# EAGLE design KitTen (EAGLE 6.5.0)
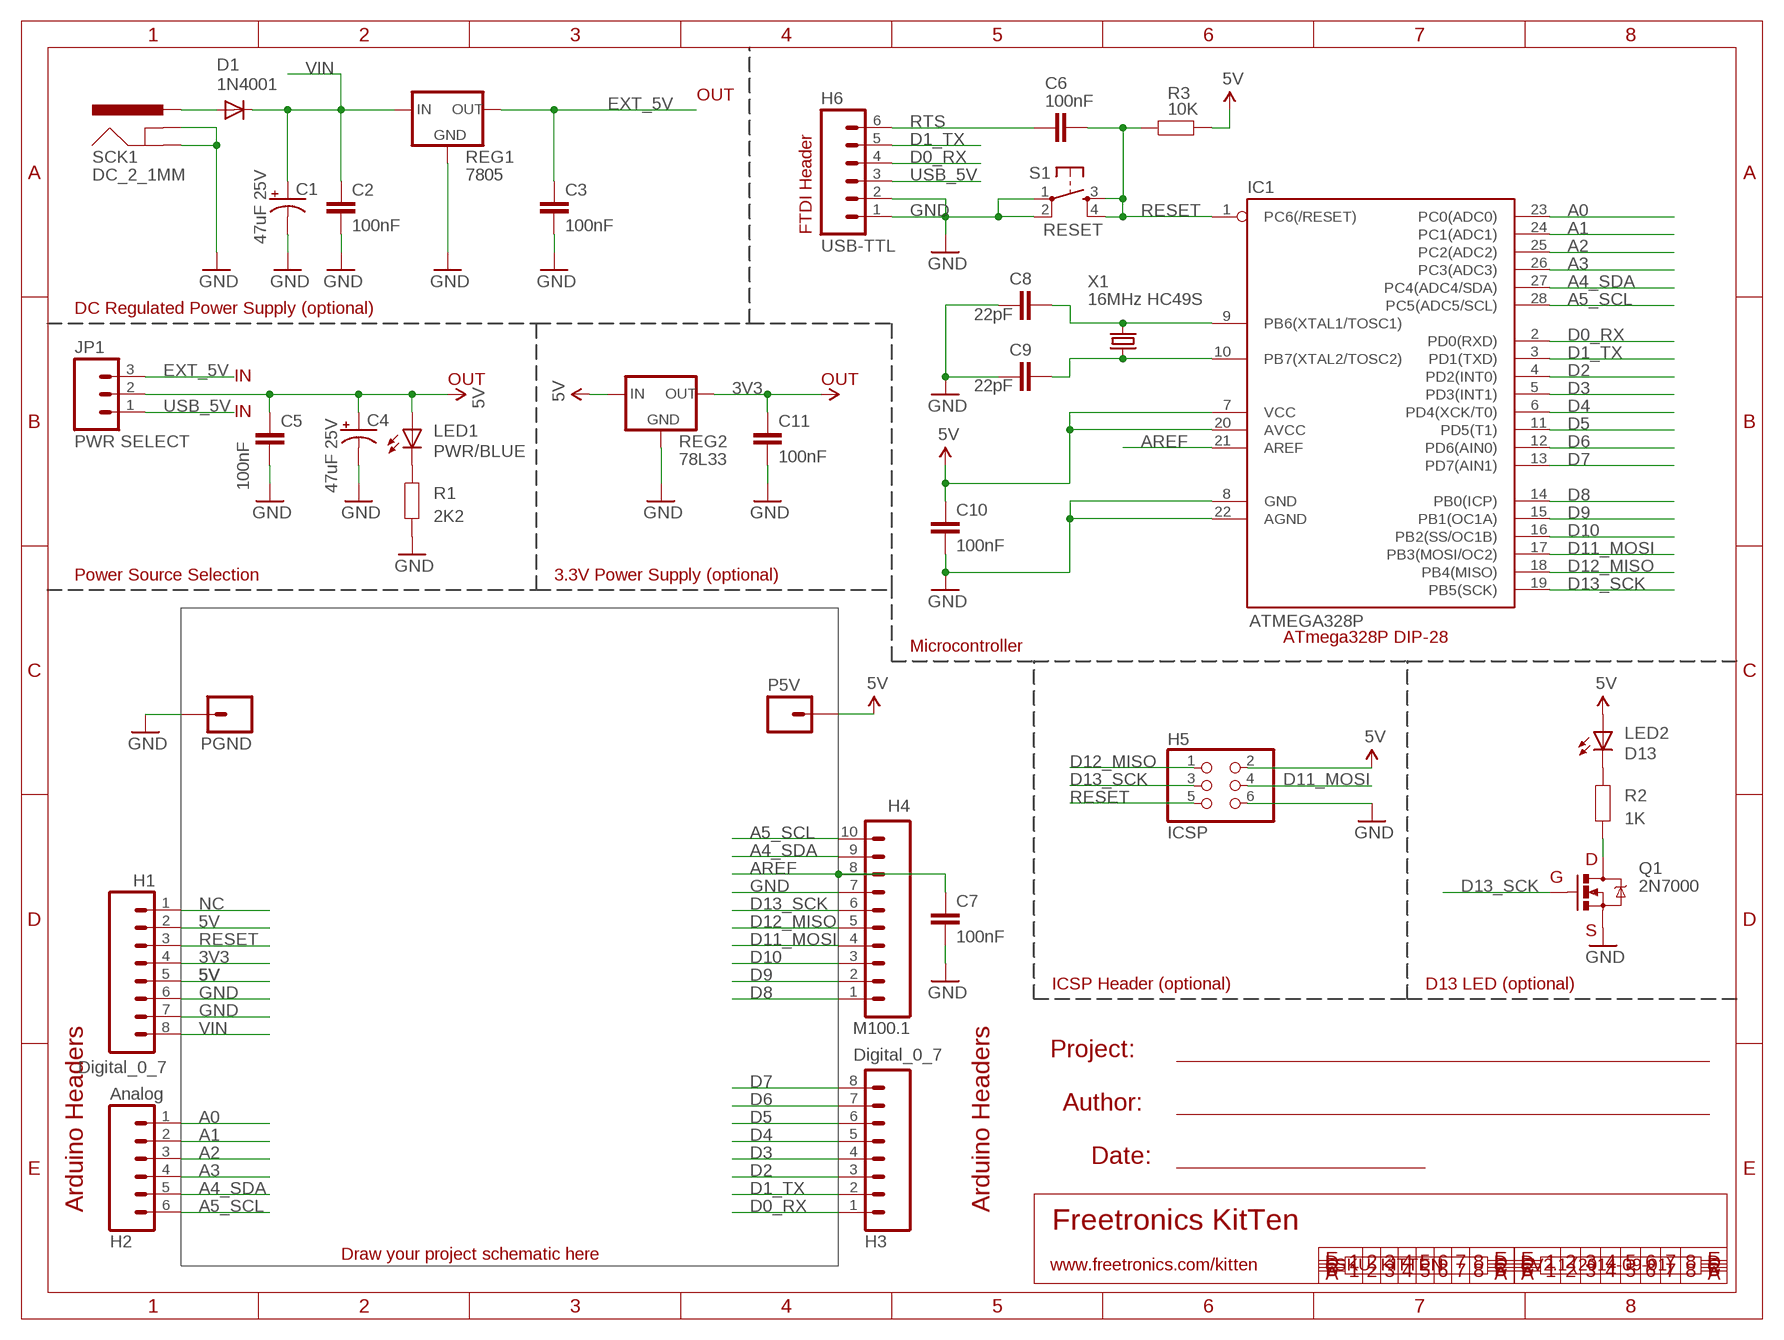
[diagram p0: schematic, sheet 1]

## Parts
C1  47uF 25V  CAP_POLPTH2  [CPOL-RADIAL-10UF-25V]
C2  100nF  CAPPTH  [CAP-PTH-SMALL]
C3  100nF  CAPPTH  [CAP-PTH-SMALL]
C4  47uF 25V  CAP_POLPTH2  [CPOL-RADIAL-10UF-25V]
C5  100nF  CAPPTH  [CAP-PTH-SMALL]
C6  100nF  CAPPTH  [CAP-PTH-SMALL]
C7  100nF  CAPPTH  [CAP-PTH-SMALL]
C8  22pF  CAPPTH  [CAP-PTH-SMALL]
C9  22pF  CAPPTH  [CAP-PTH-SMALL]
C10  100nF  CAPPTH  [CAP-PTH-SMALL]
C11  100nF  CAPPTH  [CAP-PTH-SMALL]
D1  1N4001  DIODEPTH  [DIODE-1N4001]
H1  Digital_0_7  M08  [1X08]
H2  Analog  M06SIP  [1X06]
H3  Digital_0_7  M08  [1X08]
H4  M100.1  [1X10]
H5  ICSP  PINHD-2X3  [2X03]
H6  USB-TTL  M06SIP  [1X06]
IC1  ATMEGA328P  AVR-MEGA8-P  [DIL28-3]
JP1  PWR SELECT  M03PTH  [1X03]
LED1  PWR/BLUE  LED3MM  [LED3MM]
LED2  D13  LED3MM  [LED3MM]
P5V  M01SMD  [LUXEON-PAD]
PGND  M01SMD  [LUXEON-PAD]
Q1  2N7000  MOSFET-NTO-92  [TO92]
R1  2K2  RESISTORPTH1  [AXIAL-0.3]
R2  1K  RESISTORPTH1  [AXIAL-0.3]
R3  10K  RESISTORPTH1  [AXIAL-0.3]
REG1  7805  V_REG_78XXSIDE  [78XXL]
REG2  78L33  78LXX  [TO92]
S1  RESET  TAC_SWITCHPTH  [TACTILE-PTH]
SCK1  DC_2_1MM  POWER_JACKPTH  [POWER_JACK_PTH]
X1  16MHz HC49S  CRYSTALHC49UV  [HC49U-V]

## Nets
3V3: C11.1 H1.4 REG2.1(OUT) ; supply symbol labelled 3.3V
5V: C4.1(+) C5.1 C10.1 H1.2 H1.5 H5.2 IC1.7(VCC) IC1.20(AVCC) JP1.2 LED1.A LED2.A P5V.P$1 R3.P$2 REG2.3(IN)
A0: H2.1 IC1.23(PC0(ADC0))
A1: H2.2 IC1.24(PC1(ADC1))
A2: H2.3 IC1.25(PC2(ADC2))
A3: H2.4 IC1.26(PC3(ADC3))
A4_SDA: H2.5 H4.9 IC1.27(PC4(ADC4/SDA))
A5_SCL: H2.6 H4.10 IC1.28(PC5(ADC5/SCL))
AREF: C7.1 H4.8 IC1.21(AREF)
D0_RX: H3.1 H6.4 IC1.2(PD0(RXD))
D1_TX: H3.2 H6.5 IC1.3(PD1(TXD))
D2: H3.3 IC1.4(PD2(INT0))
D3: H3.4 IC1.5(PD3(INT1))
D4: H3.5 IC1.6(PD4(XCK/T0))
D5: H3.6 IC1.11(PD5(T1))
D6: H3.7 IC1.12(PD6(AIN0))
D7: H3.8 IC1.13(PD7(AIN1))
D8: H4.1 IC1.14(PB0(ICP))
D9: H4.2 IC1.15(PB1(OC1A))
D10: H4.3 IC1.16(PB2(SS/OC1B))
D11_MOSI: H4.4 H5.4 IC1.17(PB3(MOSI/OC2))
D12_MISO: H4.5 H5.1 IC1.18(PB4(MISO))
D13_SCK: H4.6 H5.3 IC1.19(PB5(SCK)) Q1.2(G)
EXT_5V: C3.1 JP1.3 REG1.OUT
GND: C1.2(-) C2.2 C3.2 C4.2(-) C5.2 C7.2 C8.1 C9.1 C10.2 C11.2 H1.6 H1.7 H4.7 H5.6 H6.1 H6.2 IC1.8(GND) IC1.22(AGND) PGND.P$1 Q1.1(S) R1.P$1 REG1.GND REG2.2(GND) S1.1 S1.2 SCK1.GND SCK1.GNDBREAK
N$4: LED2.K(C) R2.P$2
N$5: C8.2 IC1.9(PB6(XTAL1/TOSC1)) X1.2
N$6: Q1.3(D) R2.P$1
N$7: C9.2 IC1.10(PB7(XTAL2/TOSC2)) X1.1
N$8: D1.A SCK1.PWR
N$14: LED1.K(C) R1.P$2
NC: H1.1
RESET: C6.2 H1.3 H5.5 IC1.1(PC6(/RESET)) R3.P$1 S1.3 S1.4
RTS: C6.1 H6.6
USB_5V: H6.3 JP1.1
VIN: C1.1(+) C2.1 D1.C H1.8 REG1.IN

## Notes on the sheet
- OUT
- FTDI Header
- DC Regulated Power Supply (optional)
- IN | OUT | OUT
- IN
- Power Source Selection | 3.3V Power Supply (optional)
- ATmega328P DIP-28
- Microcontroller
- D
- G
- S
- ICSP Header (optional) | D13 LED (optional)
- Project:
- Author:
- Date:
- Arduino Headers | Arduino Headers
- Freetronics KitTen
- Draw your project schematic here
- www.freetronics.com/kitten | SKU: KITTEN | V2.1 (2014-09-01)

## Library data of the parts
C1 C4 = freetronics-jon.1:CAP_POL: Capacitor Polarized These are standard SMD and PTH capacitors. Normally 10uF, 47uF, and 100uF in electrolytic and tantalum varieties. Always verify the external diameter of the through hole cap, it varies with capacity, voltage, and manufacturer. The EIA devices should be standard.
C2 C3 C5-C11 = freetronics-2:CAP: Capacitor Standard 0603 ceramic capacitor, and 0.1" leaded capacitor.
D1 = freetronics-2:DIODE: Diode These are standard reverse protection diodes and small signal diodes. SMA package can handle up to about 1A. SOD-323 can handle about 200mA. What the SOD-323 package when ordering, there are some mfgs out there that are 5-pin packages.
H1 H3 = freetronics:M08: Header 8 Standard 8-pin 0.1" header. Use with straight break away headers (SKU : PRT-00116), right angle break away headers (PRT-00553), swiss pins (PRT-00743), machine pins (PRT-00117), and female headers (PRT-00115).
H2 H6 = freetronics:M06: Header 6 Standard 6-pin 0.1" header. Use with straight break away headers (SKU : PRT-00116), right angle break away headers (PRT-00553), swiss pins (PRT-00743), machine pins (PRT-00117), and female headers (PRT-00115). Molex polarized connector foot print use with SKU : PRT-08094 with associated crimp pins and housings. NOTES ON THE VARIANTS LOCK and LOCK_LONGPADS... This footprint was designed to help hold the alignment of a through-hole component (i.e. 6-pin header) while soldering it into place. You may notice that each hole has been shifted either up or down by 0.005 of an inch from it's more standard position (which is a perfectly straight line). This slight alteration caused the pins (the squares in the middle) to touch the edges of the holes. Because they are alternating, it causes a "brace" to hold the component in place. 0.005 has proven to be the perfect amount of "off-center" position when using our standard breakaway headers. Although looks a little odd when you look at the bare footprint, once you have a header in there, the alteration is very hard to notice. Also, if you push a header all the way into place, it is covered up entirely on the bottom side. This idea of altering the position of holes to aid alignment will be further integrated into the Sparkfun Library for other footprints. It can help hold any component with 3 or more connection pins.
H4 = freetronics-marc:M10: Header 10 Standard 10-pin 0.1" header. Use with straight break away headers (SKU : PRT-00116), right angle break away headers (PRT-00553), swiss pins (PRT-00743), machine pins (PRT-00117), and female headers (PRT-00115).
H5 = pinhead:PINHD-2X3: PIN HEADER
IC1 = freetronics:AVR-MEGA8-P: MICROCONTROLLER 8 Kbytes FLASH 1 kbytes SRAM 512 bytes EEPROM USART 4-channel 10 bit ADC 2-channel 8 bit ADC
JP1 = freetronics-2:M03: Header 3 Standard 3-pin 0.1" header. Use with straight break away headers (SKU : PRT-00116), right angle break away headers (PRT-00553), swiss pins (PRT-00743), machine pins (PRT-00117), and female headers (PRT-00115). Molex polarized connector foot print use with SKU : PRT-08232 with associated crimp pins and housings.
LED1 LED2 = freetronics-2:LED: LEDs Standard schematic elements and footprints for 5mm, 3mm, 1206, and 0603 sized LEDs. 5mm - Spark Fun Electronics SKU : COM-00529 (and others)
P5V PGND = freetronics:M01: Header 1 Standard 1-pin 0.1" header. Use with straight break away headers (SKU : PRT-00116), right angle break away headers (PRT-00553), swiss pins (PRT-00743), machine pins (PRT-00117), and female headers (PRT-00115).
Q1 = freetronics-jon:MOSFET-N: Basic N-Channel MOSFET
R1-R3 = freetronics-2:RESISTOR: Resistor Basic schematic elements and footprints for 0603, 1206, and PTH 1/10th watt (small) resistors.
REG1 = freetronics-2:V_REG_78XX: Voltage Regulator Standard 7805 5V regulator. IGO (Input Ground Output). Spark Fun Electronics SKU : COM-00107
REG2 = freetronics-jon:78LXX
S1 = freetronics-2:TAC_SWITCH: Momentary Switch Button commonly used for reset or general input. Spark Fun Electronics SKU : COM-00097
SCK1 = freetronics:POWER_JACK: Power Jack This is the standard 5.5mm barrel jack for power. The PTH is the most common, proven, reliable, footprint. All others are experimental. The Slot footprint only works if the mill layer is transmitted to the PCB fab house so be warned. Spark Fun Electronics SKU : PRT-00119. Mating wall wart : TOL-00298 (and others)
X1 = freetronics:CRYSTAL: Crystals Various standard crystals. Proven footprints. Spark Fun Electronics SKU : COM-00534

## Board
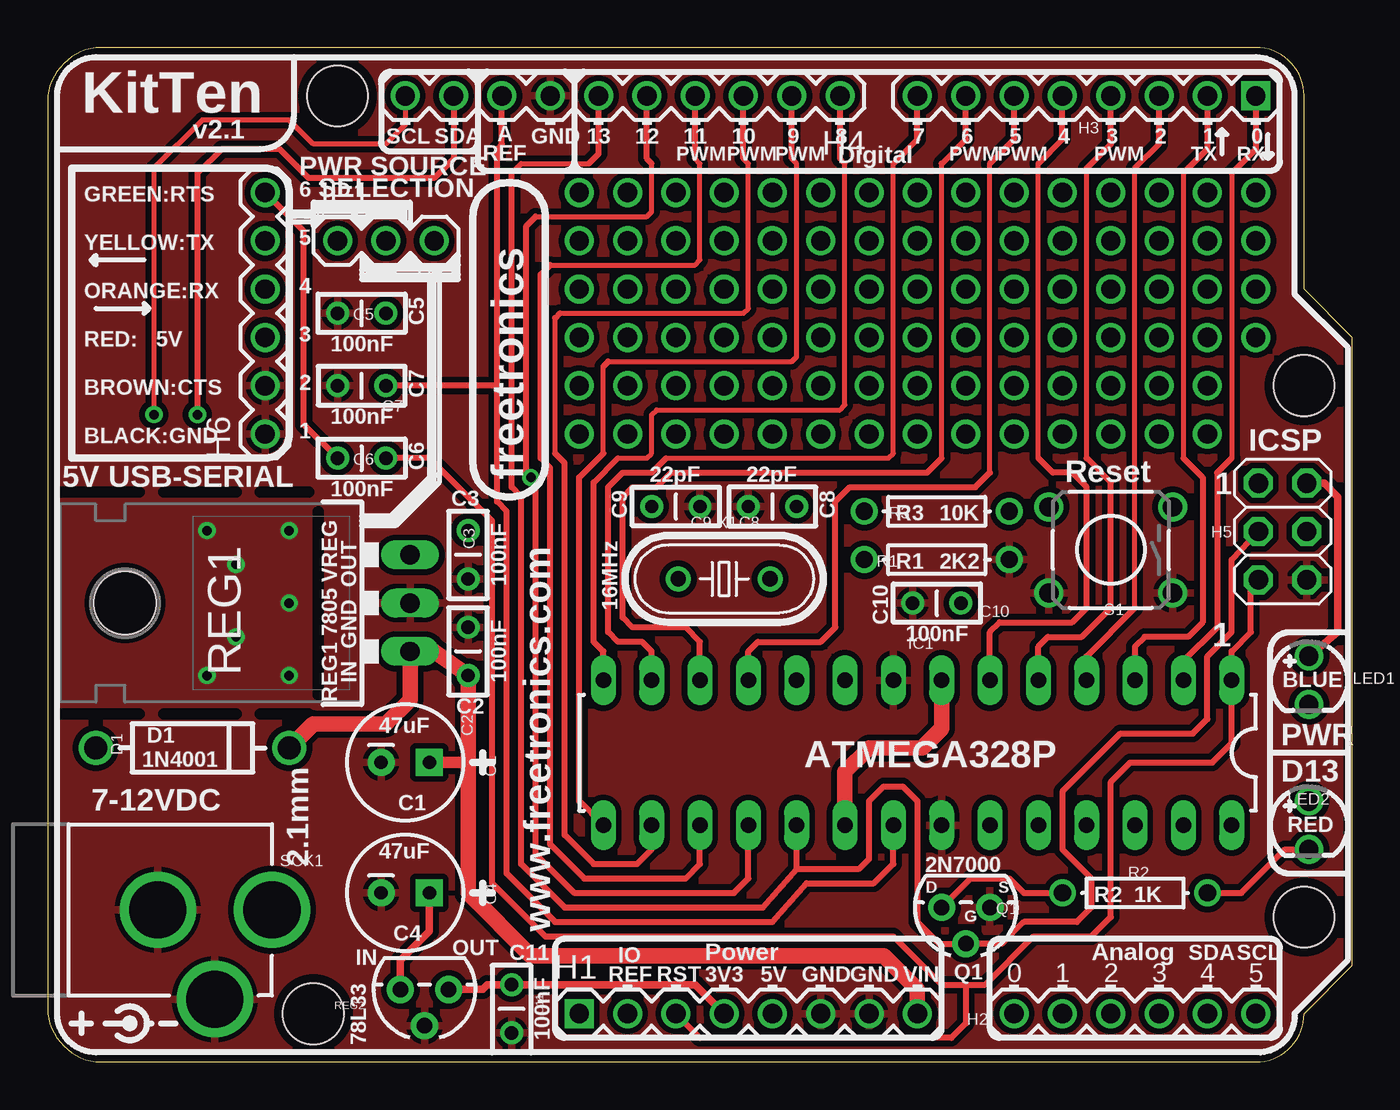
[diagram p1: board, top side]
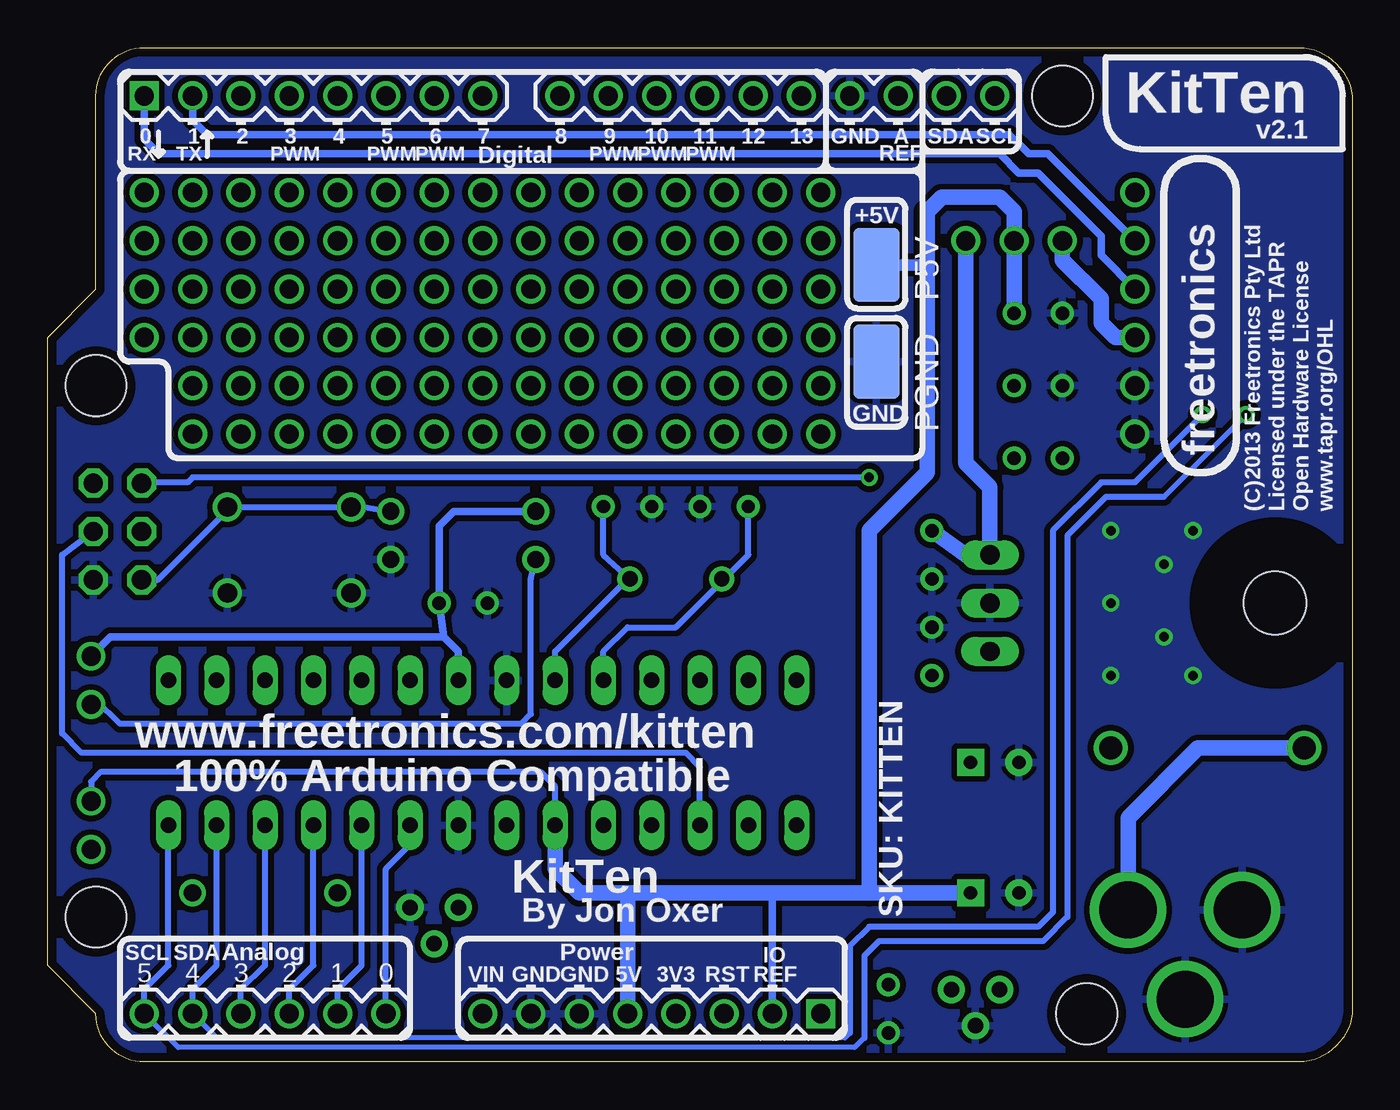
[diagram p2: board, bottom side, seen from below]

Size 68.58 x 53.34 mm. Coordinates in mm from the lower left corner, seen from the top.
Outline: 0,2.54 arc74 2.54,0 63.5,0 arc90 66.04,2.54 68.58,5.08 68.58,38.1 66.04,40.64 66.04,50.8 arc90 63.5,53.34 2.54,53.34 arc74 0,50.8 0,2.54
Copper layers (1*16): Top 0.035mm / dielectric 1.5mm / Bottom 0.035mm
Design rules "default *": minimum track width 10mil, minimum drill 18mil, track to track 10mil, track to pad 10mil, pad to pad 10mil, via to via 10mil, smd to smd 8mil, copper to edge 18mil, drill to drill 8mil, minimum pad ring 10mil, minimum via ring 8mil, stop-mask expansion 4mil, vias tented up to drill 25mil, thermal gap 10mil
Holes 3.2 mm at 66.04,35.56 66.04,7.62 15.24,50.8 13.97,2.54
tRestrict: 7 lines

### Footprints (pad centres in the part's own frame; a part is rotated, then mirrored left to right if it is on the bottom)
CPOL-RADIAL-10UF-25V = drill 0.7 pad 1.422 square: 1 1.27,0 | drill 0.7 pad 1.422: 2 -1.27,0
CAP-PTH-SMALL = drill 0.7: 1 0,0; 2 2.54,0
DIODE-1N4001 = drill 1.2: A -5.08,0; C 5.08,0
1X08 = drill 1.016 square: 1 0,0 | drill 1.016: 2 2.54,0; 3 5.08,0; 4 7.62,0; 5 10.16,0; 6 12.7,0; 7 15.24,0; 8 17.78,0
1X06 = drill 1.016: 1 0,0; 2 2.54,0; 3 5.08,0; 4 7.62,0; 5 10.16,0; 6 12.7,0
1X10 = drill 1.016: 1 0,0; 2 2.54,0; 3 5.08,0; 4 7.62,0; 5 10.16,0; 6 12.7,0; 7 15.24,0; 8 17.78,0; 9 20.32,0; 10 22.86,0
2X03 = drill 1.016 octagon: 1 -2.54,-1.27; 2 -2.54,1.27; 3 0,-1.27; 4 0,1.27; 5 2.54,-1.27; 6 2.54,1.27
DIL28-3 = drill 0.813 long: 1 -16.51,-3.81; 2 -13.97,-3.81; 3 -11.43,-3.81; 4 -8.89,-3.81; 5 -6.35,-3.81; 6 -3.81,-3.81; 7 -1.27,-3.81; 8 1.27,-3.81; 9 3.81,-3.81; 10 6.35,-3.81; 11 8.89,-3.81; 12 11.43,-3.81; 13 13.97,-3.81; 14 16.51,-3.81; 15 16.51,3.81; 16 13.97,3.81; 17 11.43,3.81; 18 8.89,3.81; 19 6.35,3.81; 20 3.81,3.81; 21 1.27,3.81; 22 -1.27,3.81; 23 -3.81,3.81; 24 -6.35,3.81; 25 -8.89,3.81; 26 -11.43,3.81; 27 -13.97,3.81; 28 -16.51,3.81
1X03 = drill 1.016: 1 0,0; 2 2.54,0; 3 5.08,0
LED3MM = drill 1: A -1.27,0; K 1.27,0
LUXEON-PAD = smd 3.9 x 2.4: P$1 0,0
TO92 = drill 0.813 pad 1.422: 1 -1.27,0; 2 0,1.905; 3 1.27,0
AXIAL-0.3 = drill 0.9: P$1 -3.81,0; P$2 3.81,0
78XXL = drill 1.016 long: GND 0,-3.81; IN -2.54,-3.81; OUT 2.54,-3.81 | hole 3.302: 0,11.176
TACTILE-PTH = drill 1.016: 1 -3.251,2.261; 2 3.251,2.261; 3 -3.251,-2.261; 4 3.251,-2.261
POWER_JACK_PTH = drill 2.997: GND 0,7.7; GNDBREAK 4.7,10.7; PWR 0,13.7
HC49U-V = drill 0.813: 1 -2.413,0; 2 2.413,0

### Placement (x,y rotation side)
C1  18.8,15.75 0 top
C2  22.1,20.32 90 top
C3  22.1,27.94 270 top
C4  18.8,8.89 0 top
C5  17.78,39.37 180 top
C6  15.24,31.75 0 top
C7  17.78,35.56 180 top
C8  36.83,29.21 0 top
C9  34.29,29.21 180 top
C10  48.01,24.13 180 top
C11  24.38,4.06 270 top
D1  7.62,16.51 0 top
H1  27.94,2.54 0 top
H2  50.8,2.54 0 top
H3  63.5,50.8 180 top
H4  41.66,50.8 180 top
H5  64.91,27.89 270 top
H6  11.43,33.02 90 top
IC1  45.72,16.26 180 top
JP1  15.24,43.18 0 top
LED1  66.29,20.07 270 top
LED2  66.29,12.45 270 top
P5V  25.02,41.91 270 bottom
PGND  25.02,36.83 270 bottom
Q1  48.26,8.13 180 top
R1  46.74,26.42 180 top
R2  57.15,8.89 0 top
R3  46.74,28.96 180 top
REG1  15.24,24.13 90 top
REG2  19.81,3.81 180 top
S1  55.88,26.92 180 top
SCK1  -1.91,8 270 top
X1  35.56,25.4 0 top

### Tracks (layer width: path | path; a pad name or v marks a point on that pad's centre or on a via)
3V3
  Top 0.406: H1.4 34.04,4.06 C11.1 23.11,4.06 22.86,3.81 REG2.1
5V
  Top 0.406: LED1.A 67.82,22.61 67.82,29.72 67.11,30.43 H5.2 | REG2.3 18.54,5.33 20.07,6.86 C4.1
  Top 0.813: IC1.20 41.91,15.24 43.18,16.51 45.97,16.51 46.99,17.53 IC1.7
  Bottom 0.305: IC1.20 41.91,14.48 42.67,15.24 65.79,15.24 66.29,14.73 LED2.A
  Bottom 0.406: LED1.A 65.28,22.35 47.75,22.35 | 47.75,22.35 46.99,21.59 IC1.7 | R3.P$2 47.24,28.96 48.01,28.19 C10.1 47.75,22.35 | H1.2 30.48,8.89
  Bottom 0.61: 22.35,41.91 P5V.P$1
  Bottom 0.813: IC1.20 41.91,10.16 40.64,8.89 38.1,8.89 | 25.4,8.89 30.48,8.89 38.1,8.89 | 25.4,8.89 25.4,27.94 22.35,30.99 22.35,41.91 22.35,44.7 21.59,45.47 18.54,45.47 17.78,44.7 JP1.2 C5.1 | H1.5 38.1,8.89 | C4.1 25.4,8.89
A0
  Bottom 0.305: H2.1 50.8,10.16 49.53,11.43 IC1.23
A1
  Bottom 0.305: H2.2 53.34,3.81 52.07,5.08 IC1.24
A2
  Bottom 0.305: H2.3 55.88,3.81 54.61,5.08 IC1.25
A3
  Bottom 0.305: H2.4 58.42,3.81 57.15,5.08 IC1.26
A4_SDA  (via drill 0.5)
  Top 0.305: H4.9 21.34,47.5 20.32,46.48 13.72,46.48 12.19,48.01 9.14,48.01 7.87,46.74 v7.87,34.04
  Bottom 0.254: 26.42,1.52 26.67,1.27 59.69,1.27 H2.5
  Bottom 0.305: H2.5 60.96,3.81 59.69,5.08 IC1.27 | v7.87,34.04 11.43,30.48 13.21,30.48 15.75,27.94 15.75,7.87 16.51,7.11 25.4,7.11 26.42,6.1 26.42,1.52
A5_SCL  (via drill 0.5)
  Top 0.254: H4.10 18.8,49.28 17.78,48.26 13.97,48.26 12.7,49.53 8.13,49.53 5.59,46.99 v5.59,34.04
  Bottom 0.254: v5.59,34.04 9.91,29.72 | 25.65,1.27 26.16,0.76 61.72,0.76 H2.6
  Bottom 0.305: H2.6 63.5,3.81 62.23,5.08 IC1.28 | 9.91,29.72 12.95,29.72 14.99,27.69 14.99,7.62 16.26,6.35 24.89,6.35 25.65,5.59 25.65,1.27
AREF
  Top 0.305: 23.62,35.56 23.62,29.46 24.13,28.96 24.13,9.91 26.67,7.37 38.1,7.37 39.88,9.4 43.43,9.4 44.45,10.41 IC1.21 | 23.62,35.56 23.62,48.01 23.88,48.26 H4.8 | 23.62,35.56 C7.1
D0_RX
  Top 0.254: 62.23,46.74 62.23,31.75
  Top 0.305: 62.23,46.74 63.5,48.01 H3.1 | 62.23,31.75 61.47,30.99 61.47,22.86 59.69,21.08 IC1.2
  Bottom 0.406: H3.1 63.5,48.51 62.74,47.75 18.54,47.75 17.53,46.74 16.51,46.74 13.21,43.43 13.21,42.42 H6.4
D1_TX
  Top 0.254: 59.69,46.74 59.69,31.75
  Top 0.305: 59.69,46.74 60.96,48.01 H3.2 | IC1.3 57.15,21.84 57.66,22.35 59.94,22.35 60.71,23.11 60.71,30.73 59.69,31.75
  Bottom 0.406: H3.2 60.96,49.53 60.2,48.77 18.03,48.77 17.02,47.75 16,47.75 H6.5
D2
  Top 0.254: 57.15,23.88 57.15,46.99
  Top 0.305: 57.15,46.99 58.42,48.26 H3.3 | IC1.4 54.61,21.34 57.15,23.88
D3
  Top 0.254: 54.61,31.75 54.61,46.99
  Top 0.305: 54.61,31.75 55.88,30.48 55.88,23.88 54.36,22.35 52.58,22.35 52.07,21.84 IC1.5 | 54.61,46.99 55.88,48.26 H3.4
D4
  Top 0.254: 52.07,31.75 52.07,47.24
  Top 0.305: IC1.6 49.53,22.61 50.04,23.11 53.85,23.11 54.61,23.88 54.61,30.23 53.85,30.99 52.83,30.99 52.07,31.75 | 52.07,47.24 53.34,48.51 H3.5
D5
  Top 0.254: 49.53,30.99 49.53,47.24
  Top 0.305: H3.6 50.8,48.51 49.53,47.24 | IC1.11 36.83,21.59 37.34,22.1 40.64,22.1 41.4,22.86 41.4,29.46 42.16,30.23 48.77,30.23 49.53,30.99
D6
  Top 0.254: 46.99,31.75 46.99,47.24
  Top 0.305: H3.7 48.26,48.51 46.99,47.24 | 46.99,31.75 46.23,30.99 32.77,30.99 32,30.23 30.73,30.23 30.23,29.72 30.23,23.37 30.73,22.86 33.53,22.86 34.29,22.1 IC1.12
D7
  Top 0.254: 44.45,47.24 44.45,32 44.2,31.75 32.51,31.75
  Top 0.305: H3.8 45.72,48.51 44.45,47.24 | IC1.13 31.75,21.59 31.24,22.1 29.97,22.1 29.46,22.61 29.46,30.23 30.23,30.99 31.75,30.99 32.51,31.75
D8
  Top 0.254: 41.66,47.5 41.91,47.24 41.91,34.54 41.66,34.29 32,34.29 31.75,34.04 31.75,32 31.5,31.75 29.97,31.75
  Top 0.305: IC1.14 29.21,21.59 28.7,22.1 28.7,30.48 29.97,31.75 | 41.66,47.5 H4.1
D9
  Top 0.254: 39.12,47.5 39.37,47.24 39.37,37.08 39.12,36.83 29.46,36.83 | 29.21,32 29.21,36.58
  Top 0.305: 29.21,36.58 29.46,36.83 | IC1.15 27.94,13.72 27.94,30.73 29.21,32 | 39.12,47.5 H4.2
D10
  Top 0.254: 36.58,47.5 36.83,47.24 36.83,39.62 36.58,39.37 26.92,39.37 | 26.67,32 26.67,39.12
  Top 0.305: 26.67,39.12 26.92,39.37 | IC1.16 31.75,11.18 30.99,10.41 28.7,10.41 27.18,11.94 27.18,31.5 26.67,32 | 36.58,47.5 H4.3
D11_MOSI
  Top 0.254: 34.04,47.5 34.29,47.24 34.29,42.16 34.04,41.91 26.42,41.91
  Top 0.305: 26.42,41.91 25.91,41.4 25.91,31.75 26.42,31.24 26.42,11.43 28.19,9.65 33.53,9.65 34.29,10.41 IC1.17 | 34.04,47.5 H4.4
  Bottom 0.305: IC1.17 34.29,15.49 35.05,16.26 66.8,16.26 67.82,17.27 67.82,26.67 H5.4
D12_MISO  (via drill 0.5)
  Top 0.254: 31.75,47.24 31.75,44.7 31.5,44.45 25.65,44.45 | 25.65,30.48 v25.4,30.73 25.15,30.99
  Top 0.305: 31.75,47.24 31.5,47.5 H4.5 | 25.65,44.45 25.15,43.94 25.15,30.99 | 25.65,30.48 25.65,10.92 27.69,8.89 36.07,8.89 36.83,9.65 IC1.18
  Bottom 0.254: v25.4,30.73 25.65,30.73
  Bottom 0.305: 25.65,30.73 60.96,30.73 61.21,30.48 62.99,30.48 H5.1
D13_SCK
  Top 0.254: 28.45,47.24 24.89,47.24 24.38,46.74
  Top 0.305: 28.45,47.24 28.96,47.75 H4.6 | 24.38,46.74 24.38,30.23 24.89,29.72 24.89,10.41 27.18,8.13 37.59,8.13 39.37,10.16 | H5.3 62.23,26.42 62.23,22.61 60.96,21.34 60.96,18.03 60.2,17.27 56.39,17.27 53.34,14.22 53.34,11.18 54.86,9.65 54.86,8.13 54.1,7.37 51.31,7.37 50.16,6.22 Q1.2 46.86,6.22 45.72,7.37 45.72,13.72 44.96,14.48 43.94,14.48 43.18,13.72 43.18,10.67 42.67,10.16 39.37,10.16 | 39.37,10.16 IC1.19
EXT_5V
  Bottom 0.813: C3.1 20.32,26.67 REG1.OUT 19.05,30.23 20.32,31.5 JP1.3
GND  (via drill 0.5)
  other vias: 12.7,27.94 12.7,24.13 12.7,20.32 8.38,27.94 8.38,20.32 9.91,26.16 9.91,22.35
  pour Bottom (isolate 0.305): 0,50.8 arc-74 2.54,53.34 63.5,53.34 arc-74 66.04,50.8 66.04,40.64 68.58,38.1 68.58,5.08 66.04,2.54 arc-74 63.5,0 2.54,0 arc-74 0,2.54
  pour Top (isolate 0.305): 0,50.8 arc-74 2.54,53.34 63.5,53.34 arc-74 66.04,50.8 66.04,40.64 68.58,38.1 68.58,5.08 66.04,2.54 arc-74 63.5,0 2.54,0 arc-74 0,2.54
N$4
  Top 0.305: R2.P$2 62.74,8.89 65.02,11.18 LED2.K
N$5
  Bottom 0.305: C8.2 39.37,26.67 X1.2 38.35,25.15 41.91,21.59 IC1.9
N$6
  Top 0.305: R2.P$1 51.31,8.89 50.55,9.65 48.51,9.65 Q1.3
N$7
  Bottom 0.305: IC1.10 39.37,21.59 38.1,22.86 35.56,22.86 33.02,25.4 | C9.2 31.75,26.67 33.02,25.4 | 33.02,25.4 X1.1
N$8
  Bottom 0.813: SCK1.PWR 11.79,12.84 8.13,16.51 D1.A
N$14
  Bottom 0.305: LED1.K 66.04,19.05 64.77,17.78 43.69,17.78 43.18,18.29 43.18,25.4 R1.P$2
N$15  (via drill 1.02)
  other vias: 33.02,40.64
N$18  (via drill 1.02)
  other vias: 33.02,43.18
N$19  (via drill 1.02)
  other vias: 33.02,45.72
N$20  (via drill 1.02)
  other vias: 30.48,40.64
N$21  (via drill 1.02)
  other vias: 30.48,43.18
N$22  (via drill 1.02)
  other vias: 30.48,45.72
N$23  (via drill 1.02)
  other vias: 27.94,40.64
N$24  (via drill 1.02)
  other vias: 27.94,43.18
N$25  (via drill 1.02)
  other vias: 27.94,45.72
N$26  (via drill 1.02)
  other vias: 40.64,40.64
N$27  (via drill 1.02)
  other vias: 40.64,43.18
N$28  (via drill 1.02)
  other vias: 40.64,45.72
N$29  (via drill 1.02)
  other vias: 38.1,40.64
N$30  (via drill 1.02)
  other vias: 38.1,43.18
N$31  (via drill 1.02)
  other vias: 38.1,45.72
N$32  (via drill 1.02)
  other vias: 35.56,40.64
N$33  (via drill 1.02)
  other vias: 35.56,43.18
N$34  (via drill 1.02)
  other vias: 35.56,45.72
N$35  (via drill 1.02)
  other vias: 48.26,40.64
N$36  (via drill 1.02)
  other vias: 48.26,43.18
N$37  (via drill 1.02)
  other vias: 48.26,45.72
N$38  (via drill 1.02)
  other vias: 45.72,40.64
N$39  (via drill 1.02)
  other vias: 45.72,43.18
N$40  (via drill 1.02)
  other vias: 45.72,45.72
N$41  (via drill 1.02)
  other vias: 43.18,40.64
N$42  (via drill 1.02)
  other vias: 43.18,43.18
N$43  (via drill 1.02)
  other vias: 43.18,45.72
N$44  (via drill 1.02)
  other vias: 55.88,40.64
N$45  (via drill 1.02)
  other vias: 55.88,43.18
N$46  (via drill 1.02)
  other vias: 55.88,45.72
N$47  (via drill 1.02)
  other vias: 53.34,40.64
N$48  (via drill 1.02)
  other vias: 53.34,43.18
N$49  (via drill 1.02)
  other vias: 53.34,45.72
N$50  (via drill 1.02)
  other vias: 50.8,40.64
N$51  (via drill 1.02)
  other vias: 50.8,43.18
N$52  (via drill 1.02)
  other vias: 50.8,45.72
N$53  (via drill 1.02)
  other vias: 63.5,40.64
N$54  (via drill 1.02)
  other vias: 63.5,43.18
N$55  (via drill 1.02)
  other vias: 63.5,45.72
N$56  (via drill 1.02)
  other vias: 60.96,40.64
N$57  (via drill 1.02)
  other vias: 60.96,43.18
N$58  (via drill 1.02)
  other vias: 60.96,45.72
N$59  (via drill 1.02)
  other vias: 58.42,40.64
N$60  (via drill 1.02)
  other vias: 58.42,43.18
N$61  (via drill 1.02)
  other vias: 58.42,45.72
N$62  (via drill 1.02)
  other vias: 33.02,33.02
N$63  (via drill 1.02)
  other vias: 33.02,35.56
N$64  (via drill 1.02)
  other vias: 33.02,38.1
N$65  (via drill 1.02)
  other vias: 30.48,33.02
N$66  (via drill 1.02)
  other vias: 30.48,35.56
N$67  (via drill 1.02)
  other vias: 30.48,38.1
N$68  (via drill 1.02)
  other vias: 27.94,33.02
N$69  (via drill 1.02)
  other vias: 27.94,35.56
N$70  (via drill 1.02)
  other vias: 27.94,38.1
N$71  (via drill 1.02)
  other vias: 40.64,33.02
N$72  (via drill 1.02)
  other vias: 40.64,35.56
N$73  (via drill 1.02)
  other vias: 40.64,38.1
N$74  (via drill 1.02)
  other vias: 38.1,33.02
N$75  (via drill 1.02)
  other vias: 38.1,35.56
N$76  (via drill 1.02)
  other vias: 38.1,38.1
N$77  (via drill 1.02)
  other vias: 35.56,33.02
N$78  (via drill 1.02)
  other vias: 35.56,35.56
N$79  (via drill 1.02)
  other vias: 35.56,38.1
N$80  (via drill 1.02)
  other vias: 48.26,33.02
N$81  (via drill 1.02)
  other vias: 48.26,35.56
N$82  (via drill 1.02)
  other vias: 48.26,38.1
N$83  (via drill 1.02)
  other vias: 45.72,33.02
N$84  (via drill 1.02)
  other vias: 45.72,35.56
N$85  (via drill 1.02)
  other vias: 45.72,38.1
N$86  (via drill 1.02)
  other vias: 43.18,33.02
N$87  (via drill 1.02)
  other vias: 43.18,35.56
N$88  (via drill 1.02)
  other vias: 43.18,38.1
N$89  (via drill 1.02)
  other vias: 55.88,33.02
N$90  (via drill 1.02)
  other vias: 55.88,35.56
N$91  (via drill 1.02)
  other vias: 55.88,38.1
N$92  (via drill 1.02)
  other vias: 53.34,33.02
N$93  (via drill 1.02)
  other vias: 53.34,35.56
N$94  (via drill 1.02)
  other vias: 53.34,38.1
N$95  (via drill 1.02)
  other vias: 50.8,33.02
N$96  (via drill 1.02)
  other vias: 50.8,35.56
N$97  (via drill 1.02)
  other vias: 50.8,38.1
N$100  (via drill 1.02)
  other vias: 63.5,38.1
N$101  (via drill 1.02)
  other vias: 60.96,33.02
N$102  (via drill 1.02)
  other vias: 60.96,35.56
N$103  (via drill 1.02)
  other vias: 60.96,38.1
N$104  (via drill 1.02)
  other vias: 58.42,33.02
N$105  (via drill 1.02)
  other vias: 58.42,35.56
N$106  (via drill 1.02)
  other vias: 58.42,38.1
RESET
  Top 0.305: H5.5 63.25,24.96 63.25,22.61 62.23,21.59 IC1.1 62.23,16.76 61.21,15.75 56.9,15.75 55.88,14.73 55.88,7.62 54.86,6.6 51.82,6.6 49.28,4.06 48.26,4.06 | 48.26,4.06 48.26,2.03 47.5,1.27 34.29,1.27 H1.3 | 48.26,4.06 46.99,4.06 44.45,6.6 26.16,6.6 23.37,9.4 23.37,28.45 20.07,31.75 C6.2
  Bottom 0.305: H5.5 62.79,25.35 58.93,29.21 S1.3 S1.4 52.07,29.21 R3.P$1
RTS
  Top 0.305: C6.1 13.46,33.53 13.46,43.69 H6.6
USB_5V
  Bottom 0.813: H6.3 12.45,38.1 13.21,38.86 13.21,40.13 15.24,42.16 JP1.1
VIN
  Top 0.61: C1.1 21.84,15.75 22.1,15.49
  Top 0.813: H1.8 45.72,3.81 43.94,5.59 25.4,5.59 22.1,8.89 22.1,15.49 C2.1 20.32,21.59 REG1.IN 19.05,19.05 17.78,17.78 13.97,17.78 D1.C

### Text on the board
tPlace: KitTen | v2.1 | SCL | SDA | A | GND | 13 | 12 | 11 | 10 | 9 | 8 | 7 | 6 | 5 | 4 | 3 | 2 | 1 | 0 | PWR SOURCE | REF | PWM | PWM | PWM | Digital | PWM | PWM | PWM | TX | RX | GREEN:RTS | 6 | SELECTION | YELLOW:TX | 5 | ORANGE:RX | 4 | C5 | RED: 5V | 3 | 100nF | BROWN:CTS | 2 | C7 | 100nF | BLACK:GND | 1 | ICSP | C6 | freetronics | 5V USB-SERIAL | 100nF | 22pF | 22pF | Reset | 1 | C3 | C9 | C8 | R3 | 10K | R1 | 2K2 | 100nF | 16MHz | C10 | 100nF | 1 | IN GND OUT | 100nF | BLUE | REG1 7805 VREG | C2 | D1 | 47uF | PWR | 1N4001 | ATMEGA328P | D13 | 7-12VDC | C1 | RED | 47uF | 2.1mm | 2N7000 | D | S | R2 1K | www.freetronics.com | G | C4 | OUT | IN | C11 | IO | Power | Analog | SDA | SCL | REF | RST | 3V3 | 5V | GND | GND | VIN | Q1 | 0 | 1 | 2 | 3 | 4 | 5 | 78L33 | 100nF
bPlace: KitTen | v2.1 | SCL | SDA | A | GND | 13 | 12 | 11 | 10 | 9 | 8 | 7 | 6 | 5 | 4 | 3 | 2 | 1 | 0 | REF | PWM | PWM | PWM | Digital | PWM | PWM | PWM | TX | RX | +5V | GND | freetronics | www.tapr.org/OHL | Open Hardware License | Licensed under the TAPR | (C)2013 Freetronics Pty Ltd | www.freetronics.com/kitten | 100% Arduino Compatible | KitTen | SKU: KITTEN | By Jon Oxer | IO | Power | Analog | SDA | SCL | REF | RST | 3V3 | 5V | GND | GND | VIN | 0 | 1 | 2 | 3 | 4 | 5